# Altium schematic sheet Motor and Gyro.SchDoc
size A4; SheetNumber: 4; SheetTotal: 7
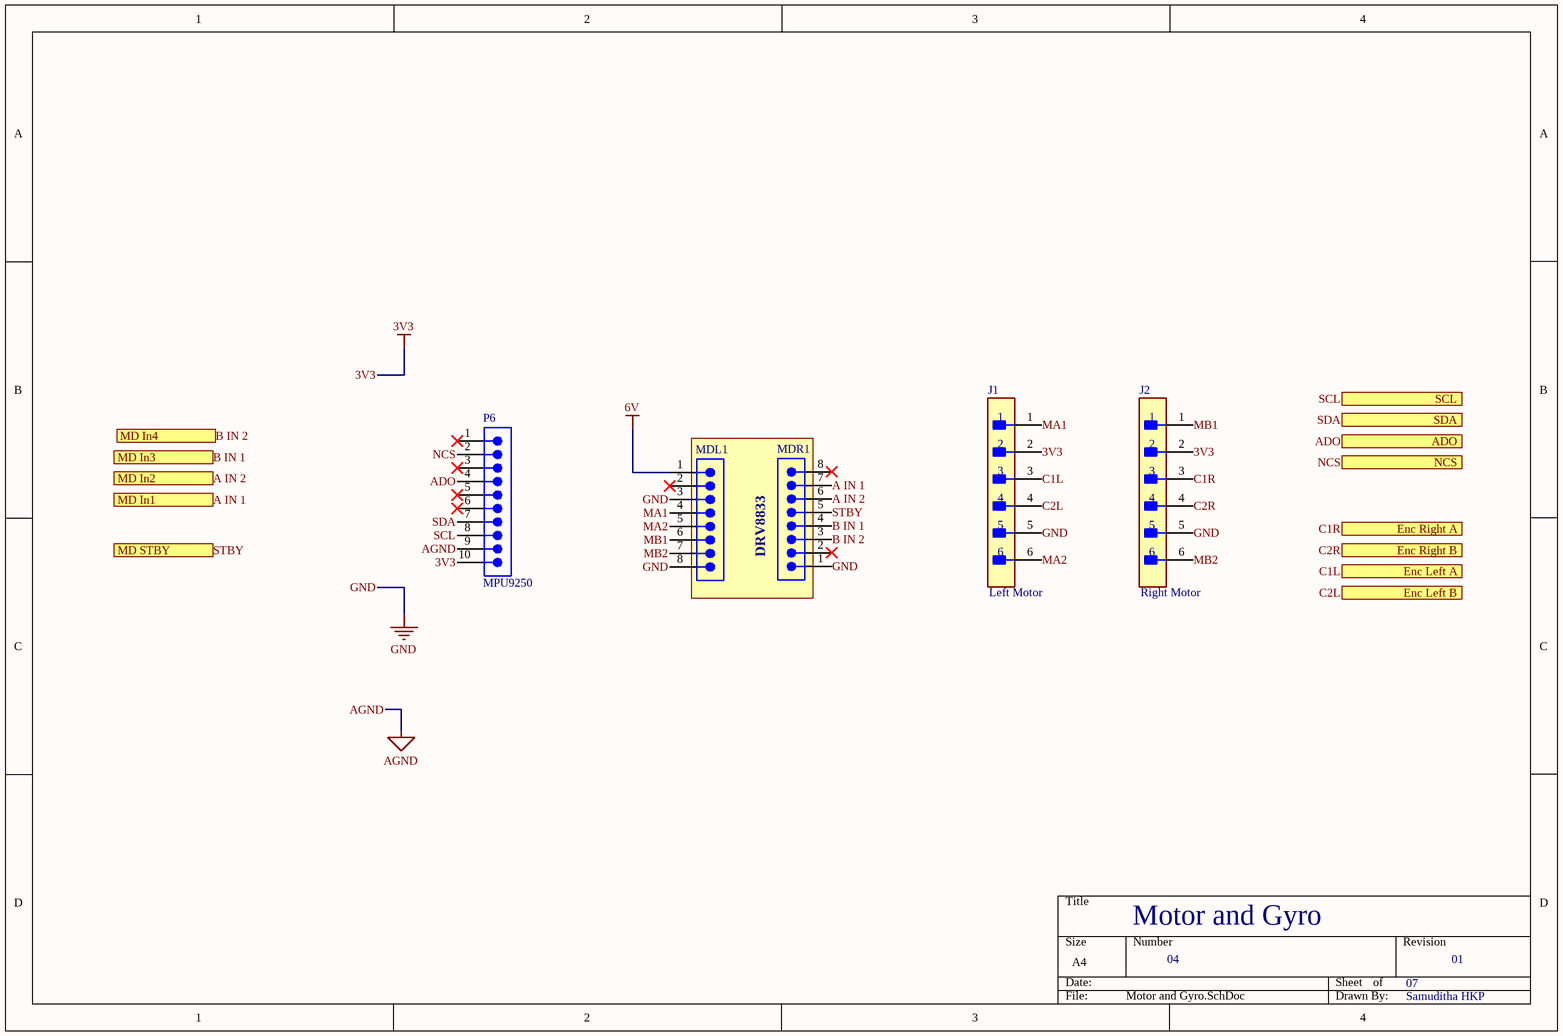
[diagram p0: Motor and Gyro.SchDoc]

## Parts
J1  Left Motor  [FP-B6B-EH-A_LF_SN-MFG]
J2  Right Motor  [FP-B6B-EH-A_LF_SN-MFG]
MDL1  61300811121  [61300811121]  (value not drawn)
MDR1  61300811121  [61300811121]  (value not drawn)
P6  MPU9250  [61301011121]

## Blocks framed on the sheet
DRV8833: MDL1 MDR1

## Ports
ADO (out, see Main[4C], MCU[1C]), Enc Left A (out, see Main[4B], MCU[1B]), Enc Left B (out, see Main[4B], MCU[1B]), Enc Right A (out, see Main[4B], MCU[1B]), Enc Right B (out, see Main[4B], MCU[1B]), MD In1 (in, see Main[3B], MCU[4A]), MD In2 (in, see Main[3B], MCU[4B]), MD In3 (in, see Main[3B], MCU[4B]), MD In4 (in, see Main[3B], MCU[4B]), MD STBY (in, see Main[3B], MCU[4B]), NCS (out, see Main[4C], MCU[1C]), SCL (out, see Main[4B], MCU[1C]), SDA (out, see Main[4B], MCU[1C])

## Nets
3V3: J1.2 J2.2 P6.10
6V: MDL1.1
AGND: P6.9
GND: J1.5 J2.5 MDL1.3 MDL1.8 MDR1.1
A IN 1: MDR1.7 ; port MD In1
A IN 2: MDR1.6 ; port MD In2
ADO: P6.4 ; port ADO
B IN 1: MDR1.4 ; port MD In3
B IN 2: MDR1.3 ; port MD In4
C1L: J1.3 ; port Enc Left A
C1R: J2.3 ; port Enc Right A
C2L: J1.4 ; port Enc Left B
C2R: J2.4 ; port Enc Right B
MA1: J1.1 MDL1.4
MA2: J1.6 MDL1.5
MB1: J2.1 MDL1.6
MB2: J2.6 MDL1.7
NCS: P6.2 ; port NCS
SCL: P6.8 ; port SCL
SDA: P6.7 ; port SDA
STBY: MDR1.5 ; port MD STBY

Not connected (* = marked no-connect by the designer): MDL1 2*; MDR1 2* 8*; P6 1* 3* 5* 6*

## Notes on the sheet
- Motor and Gyro
- 04
- 07
- 01
- Samuditha HKP

## Library data of the parts
J1 J2 = CMP-17439-000293-1: CONN HEADER VERT 6POS 2.5MM; Voltage Rating: 250V; Number of Positions: 6; Current Rating: 3A; Mated Stacking Heights: 8.1mm; Gender: Male; Insulation Material: Nylon; Number of Contacts: 6; Contact Plating: Tin; Pitch: 2.5mm; Orientation: Straight; Insulation Color: Natural; Packaging: Bulk; Termination: Solder; Flammability Rating: UL94 V-0; Lead Free: Lead Free; Contact Mating Length: 0.13inch; Color: Natural; Contact Finish - Mating: TIN; Connector Type: Header; Contact Shape: Square; Contact Type: Male Pin; Series: EH; Contact Material: Brass; Fastening Type: Friction; Number of Rows: 1; Mount: Through Hole; Housing Color: White
MDL1 MDR1 = CMP-1502-01076-3: NexarPartId: 32855533; Connector Type: Male Pin; Number of Contacts: 8; Voltage Rating: 250V; Current Rating: 3A; Contact Resistance: 20mΩ; Pitch: 2.54mm; Gender: Male; Termination: Solder; Contact Material: Copper; Mount: Through Hole; Lead Pitch: 2.54mm; Number of Positions: 8; Operating Supply Voltage: 250V; Number of Pins: 8; Max Operating Temperature: 105°C; Height: 8.54mm; REACH SVHC: Unknown; Number of Rows: 1; Packaging: Bulk; Contact Plating: Gold; Contact Mating Length: 5.9944mm; Orientation: Vertical; RoHS: Compliant; Color: Black; Min Operating Temperature: -40°C
P6 = CMP-1502-01082-5: NexarPartId: 18818159; Gender: Male; Number of Positions: 10; Operating Supply Voltage: 250V; Current Rating: 3A; Contact Resistance: 20mΩ; Connector Type: Male Pin; Insulation Resistance: 1GΩ; Pitch: 2.54mm; Color: Black; Contact Gender: Male; Height: 8.74mm; Orientation: Vertical; RoHS: Compliant; Packaging: Bulk; Min Operating Temperature: -40°C; Number of Pins: 10; Max Operating Temperature: 105°C; REACH SVHC: Unknown; Voltage Rating: 250V; Number of Rows: 1; Housing Material: PBT; Number of Contacts: 10; Mount: Through Hole; Contact Mating Length: 5.9944mm; Length: 2.54mm; Lead Pitch: 2.54mm; Flammability Rating: UL94 V-0; Termination: Solder; Contact Material: Copper; Width: 25.4mm; Contact Plating: Gold